# EAGLE design beginner (EAGLE 9.3.0)
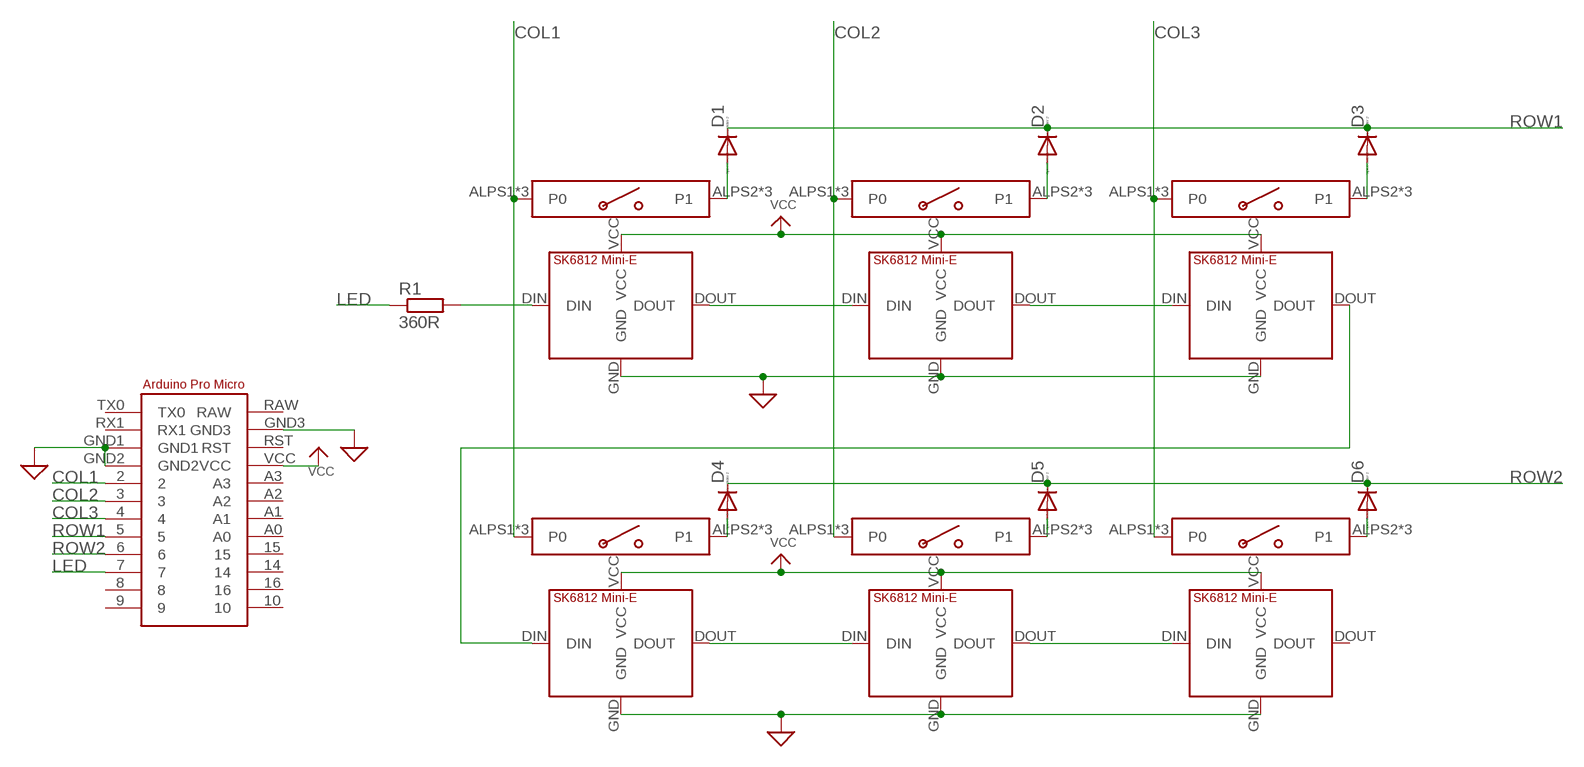
[diagram p0: schematic, sheet 1]

## Parts
D1  1N41481N4148_THROUGH  [DIODE-1N4148]
D2  1N41481N4148_THROUGH  [DIODE-1N4148]
D3  1N41481N4148_THROUGH  [DIODE-1N4148]
D4  1N41481N4148_THROUGH  [DIODE-1N4148]
D5  1N41481N4148_THROUGH  [DIODE-1N4148]
D6  1N41481N4148_THROUGH  [DIODE-1N4148]
R1  360R  RESISTOR-THT  [THT-RESISTOR]
U$1  ARDUINO_PRO_MICRO  [ARDUINO_PRO_MICRO]
U$2  KEYSWITCH-SK6812  [UNIVERSAL_KEYSWITCH_SK6812MINIE]
U$3  KEYSWITCH-SK6812  [UNIVERSAL_KEYSWITCH_SK6812MINIE]
U$4  KEYSWITCH-SK6812  [UNIVERSAL_KEYSWITCH_SK6812MINIE]
U$5  KEYSWITCH-SK6812  [UNIVERSAL_KEYSWITCH_SK6812MINIE]
U$6  KEYSWITCH-SK6812  [UNIVERSAL_KEYSWITCH_SK6812MINIE]
U$7  KEYSWITCH-SK6812  [UNIVERSAL_KEYSWITCH_SK6812MINIE]

## Nets
COL1: U$1.2 U$2.ALPS1(P0) U$2.CHOC1(P0) U$2.MX1(P0) U$5.ALPS1(P0) U$5.CHOC1(P0) U$5.MX1(P0)
COL2: U$1.3 U$3.ALPS1(P0) U$3.CHOC1(P0) U$3.MX1(P0) U$6.ALPS1(P0) U$6.CHOC1(P0) U$6.MX1(P0)
COL3: U$1.4 U$4.ALPS1(P0) U$4.CHOC1(P0) U$4.MX1(P0) U$7.ALPS1(P0) U$7.CHOC1(P0) U$7.MX1(P0)
GND: U$1.GND1 U$1.GND2 U$1.GND3 U$2.GND U$3.GND U$4.GND U$5.GND U$6.GND U$7.GND ; supply symbol labelled SUP
LED: R1.1 U$1.7
N$1: U$2.DOUT U$3.DIN
N$2: U$3.DOUT U$4.DIN
N$3: D1.A U$2.ALPS2(P1) U$2.CHOC2(P1) U$2.MX2(P1)
N$4: D2.A U$3.ALPS2(P1) U$3.CHOC2(P1) U$3.MX2(P1)
N$5: D3.A U$4.ALPS2(P1) U$4.CHOC2(P1) U$4.MX2(P1)
N$7: D4.A U$5.ALPS2(P1) U$5.CHOC2(P1) U$5.MX2(P1)
N$9: U$5.DOUT U$6.DIN
N$10: U$6.DOUT U$7.DIN
N$12: D6.A U$7.ALPS2(P1) U$7.CHOC2(P1) U$7.MX2(P1)
N$13: D5.A U$6.ALPS2(P1) U$6.CHOC2(P1) U$6.MX2(P1)
N$19: U$4.DOUT U$5.DIN
N$21: R1.2 U$2.DIN
ROW1: D1.C D2.C D3.C U$1.5
ROW2: D4.C D5.C D6.C U$1.6
VCC: U$1.VCC U$2.VCC U$3.VCC U$4.VCC U$5.VCC U$6.VCC U$7.VCC
Unconnected: U$1.8 U$1.9 U$1.10 U$1.14 U$1.15 U$1.16 U$1.A0 U$1.A1 U$1.A2 U$1.A3 U$1.RAW U$1.RST U$1.RX1 U$1.TX0 U$7.DOUT

## Library data of the parts
D1-D6 = DIYKeyboard:1N4148
R1 = DIYKeyboard:RESISTOR
U$1 = DIYKeyboard:ARDUINO_PRO_MICRO
U$2-U$7 = DIYKeyboard:KEYSWITCH-SK6812

## Board
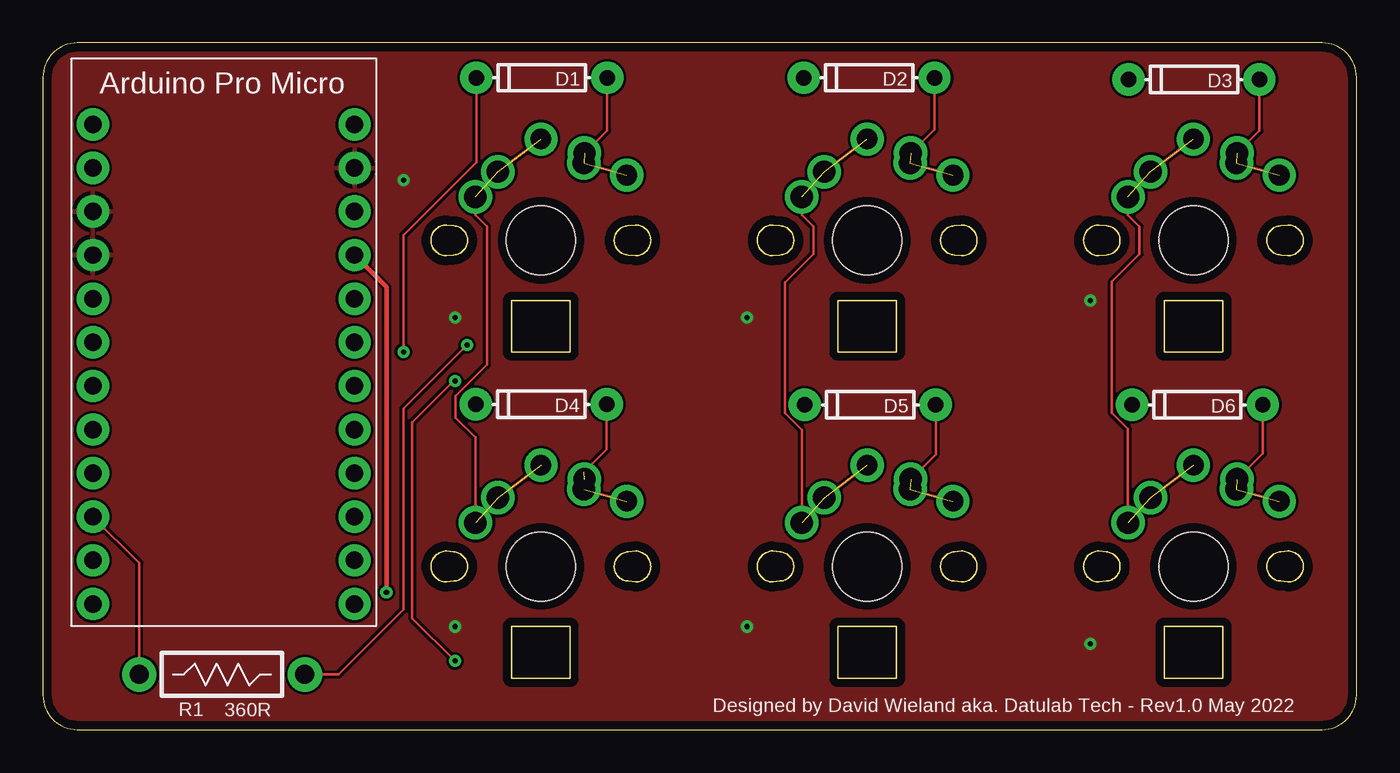
[diagram p1: board, top side]
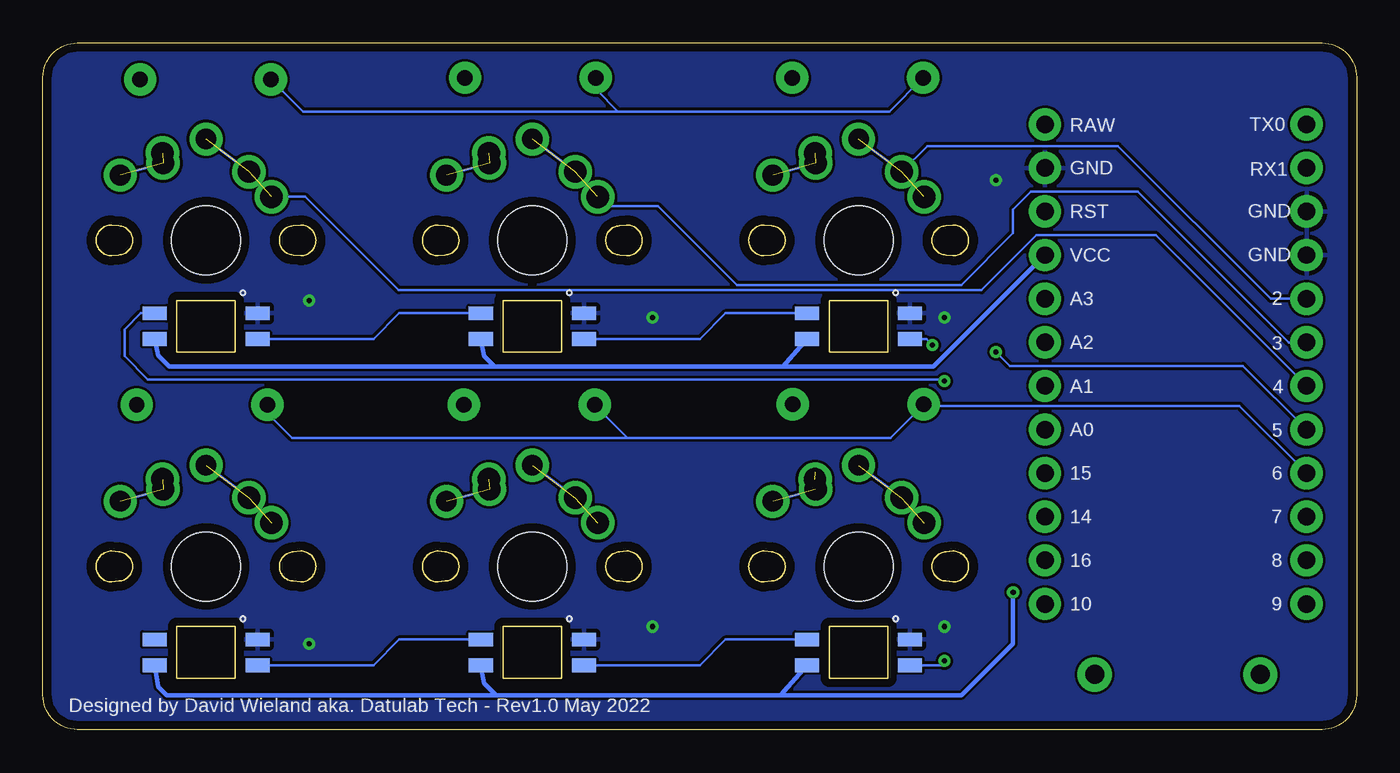
[diagram p2: board, bottom side, seen from below]

Size 76.5 x 40 mm. Coordinates in mm from the lower left corner, seen from the top.
Outline: 0,38 0,2 arc90 2,0 74.5,0 arc90 76.5,2 76.5,38 arc90 74.5,40 2,40 arc90 0,38
Copper layers (1*16): Top 0.035mm / dielectric 1.5mm / Bottom 0.035mm
Design rules "default *": minimum track width 6mil, minimum drill 0.3mm, track to track 6mil, track to pad 6mil, pad to pad 6mil, via to via 6mil, smd to smd 6mil, copper to edge 20mil, drill to drill 6mil, minimum pad ring 10mil, minimum via ring 8mil, stop-mask expansion 4mil, vias tented up to drill 40mil, thermal gap 10mil

### Footprints (pad centres in the part's own frame; a part is rotated, then mirrored left to right if it is on the bottom)
DIODE-1N4148 = drill 0.9 pad 1.88: A -3.81,0; C 3.81,0
THT-RESISTOR = drill 1.1 pad 2: 1 -4.82,0; 2 4.82,0
ARDUINO_PRO_MICRO = drill 1.016 pad 1.88: 2 -7.62,2.54; 3 -7.62,0; 4 -7.62,-2.54; 5 -7.62,-5.08; 6 -7.62,-7.62; 7 -7.62,-10.16; 8 -7.62,-12.7; 9 -7.62,-15.24; 10 7.62,-15.24; 14 7.62,-10.16; 15 7.62,-7.62; 16 7.62,-12.7; A0 7.62,-5.08; A1 7.62,-2.54; A2 7.62,0; A3 7.62,2.54; GND1 -7.62,7.62; GND2 -7.62,5.08; GND3 7.62,10.16; RAW 7.62,12.7; RST 7.62,7.62; RX1 -7.62,10.16; TX0 -7.62,12.7; VCC 7.62,5.08
UNIVERSAL_KEYSWITCH_SK6812MINIE = drill 1.3 pad 1.93: ALPS1 -2.5,4; ALPS2 2.5,4.5; MX1 -3.81,2.54; MX2 2.54,5.08 | drill 1.2 pad 1.93: CHOC1 0,5.9; CHOC2 5,3.8 | smd 1.4 x 0.8 bottom: DIN -3,-5.75; DOUT 3,-4.25; GND -3,-4.25; VCC 3,-5.75 | hole 4: 0,0

### Placement (x,y rotation side)
D1  29.05,37.97 180 top
D2  48.11,37.97 180 top
D3  67.03,37.87 180 top
D4  29.02,18.95 180 top
D5  48.18,18.92 180 top
D6  67.23,18.92 180 top
R1  10.43,3.21 0 top
U$1  10.53,22.56 0 top
U$2  29,28.5 0 top
U$3  48,28.5 0 top
U$4  67,28.5 0 top
U$5  29,9.5 0 top
U$6  48,9.5 0 top
U$7  67,9.5 0 top

### Tracks (layer width: path | path; a pad name or v marks a point on that pad's centre or on a via)
COL1  (4 unrouted)
  Top 0.152: U$2.MX1 25.19,29.98 25.86,29.3 25.86,21.25 24.04,19.43 24.04,18.17 25.19,17.02 U$5.MX1
  Bottom 0.152: U$1.2 5,25.1 13.9,34 25,34 U$2.ALPS1
COL2  (4 unrouted)
  Top 0.152: U$3.MX1 44.19,29.98 44.86,29.3 44.86,27.7 43.2,26.04 43.2,18.44 44.19,17.45 U$6.MX1
  Bottom 0.152: U$1.3 3.96,22.56 12.75,31.35 18.95,31.35 20,30.3 20,28.91 23,25.91 36.09,25.91 40.67,30.49 43.64,30.49 U$3.MX1
COL3  (4 unrouted)
  Top 0.152: U$4.MX1 63.19,29.98 63.86,29.3 63.86,27.7 62.25,26.09 62.25,18.44 63.19,17.5 U$7.MX1
  Bottom 0.152: U$1.4 11.7,28.81 18.63,28.81 21.84,25.6 55.79,25.6 61.22,31.04 U$4.MX1
GND  (via drill 0.3)
  other vias: 21,32 24,24 24,6 41,6 61,5 41,24 61,25
  pour Bottom: -1,41 -1,-1 78,-1 78,41
  pour Top: -1,41 -1,-1 78,-1 78,41
LED
  Top 0.152: R1.1 5.61,9.7 U$1.7
N$1
  Bottom 0.152: U$2.DOUT 36.75,24.25 38.25,22.75 U$3.DIN
N$2
  Bottom 0.152: U$3.DOUT 55.75,24.25 57.25,22.75 U$4.DIN
N$3  (2 unrouted)
  Top 0.152: U$2.MX2 32.86,34.9 D1.A
N$4  (2 unrouted)
  Top 0.152: U$3.MX2 51.92,34.96 D2.A
N$5  (2 unrouted)
  Top 0.152: U$4.MX2 70.84,34.88 D3.A
N$7  (2 unrouted)
  Top 0.152: U$5.ALPS2 31.5,15 32.83,16.33 D4.A
N$9
  Bottom 0.152: U$5.DOUT 36.75,5.25 38.25,3.75 U$6.DIN
N$10
  Bottom 0.152: U$6.DOUT 55.75,5.25 57.25,3.75 U$7.DIN
N$12  (2 unrouted)
  Top 0.152: U$7.MX2 71.04,16.08 D6.A
N$13  (2 unrouted)
  Top 0.152: U$6.MX2 51.99,16.03 D5.A
N$19  (via drill 0.3)
  Top 0.152: v24,20.3 23.91,20.3 21.51,17.9 21.51,6.49 v24,4
  Bottom 0.152: U$4.DOUT 70.8,24.25 71.75,23.3 71.75,21.75 70.4,20.4 24.1,20.4 v24,20.3 | v24,4 24,3.95 24.2,3.75 U$5.DIN
N$21  (via drill 0.3)
  Top 0.152: R1.2 17.21,3.21 21,7 21,18.7 v24.7,22.4
  Bottom 0.152: v24.7,22.4 25.05,22.75 U$2.DIN
ROW1  (via drill 0.3)
  Top 0.152: v21,22 21,28.82 25.24,33.06 D1.C
  Bottom 0.152: D1.C 27.21,36 43,36 | D3.C 61.35,36 43,36 | D2.C 44.3,37.3 43,36 | v21,22 20.19,21.19 6.62,21.19 U$1.5
ROW2
  Bottom 0.152: 42.45,17 27.16,17 D4.C 25.11,18.85 6.82,18.85 U$1.6 | 42.45,17 62,17 63.42,18.42 D6.C | D5.C 42.45,17
VCC  (via drill 0.3)
  Top 0.254: U$1.VCC 20,25.79 v20,8
  Bottom 0.254: U$5.VCC 33.55,2 | 33.55,2 50.1,2 | 50.1,2 69.3,2 69.8,2.5 U$7.VCC | U$6.VCC 50.8,2.7 50.1,2 | U$2.VCC 33.39,21.16 | U$4.VCC 69.8,21.8 69.16,21.16 50.2,21.16 | 33.39,21.16 50.2,21.16 | U$3.VCC 50.8,21.76 50.2,21.16 | U$1.VCC 24.63,21.16 33.39,21.16 | v20,8 20,5 23,2 33.55,2

### Text on the board
tNames: Designed by David Wieland aka. Datulab Tech - Rev1.0 May 2022
bNames: Designed by David Wieland aka. Datulab Tech - Rev1.0 May 2022